# EAGLE schematic Adapter (EAGLE 7.1.0)
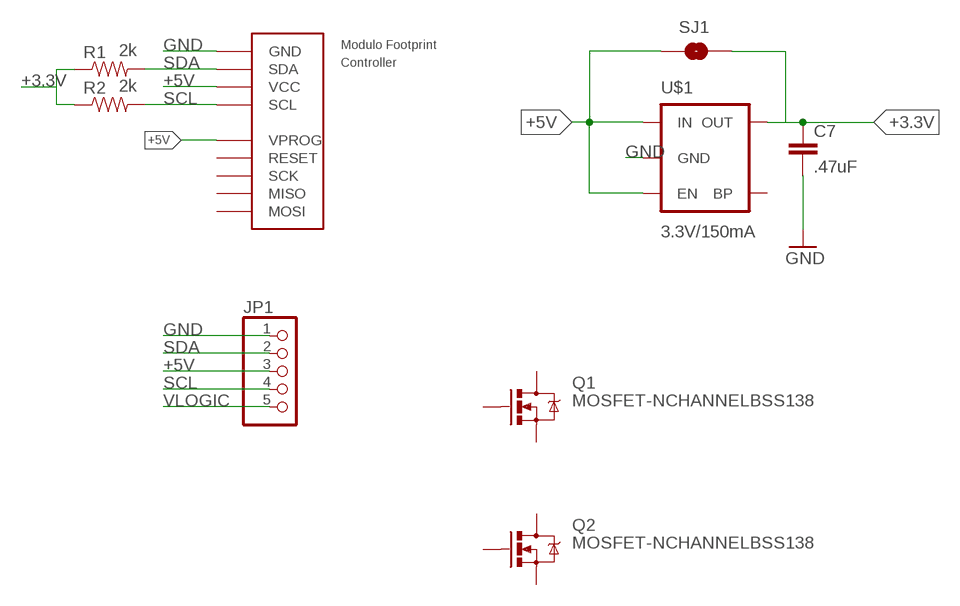
[diagram p0: schematic, sheet 1]

## Parts
C7  .47uF  CAP0805  [0805]
FOOTPRINT  Controller  FOOTPRINTFOOTPRINT-2  [FOOTPRINT2]
JP1  PINHD-1X5/90  [1X05/90]
Q1  MOSFET-NCHANNELBSS138  [SOT23]
Q2  MOSFET-NCHANNELBSS138  [SOT23]
R1  2k  RESISTOR0805-RES  [0805]
R2  2k  RESISTOR0805-RES  [0805]
SJ1  SOLDERJUMPERNO  [SJ_2S-NO]
U$1  3.3V/150mA  V_REG_MIC52053.3V  [SOT23-5]

## Nets
+3.3V: C7.1 R1.1 R2.1 SJ1.2 U$1.5(OUT)
+5V: FOOTPRINT.BUS2(VCC) FOOTPRINT.PROG0(VPROG) JP1.3 SJ1.1 U$1.1(IN) U$1.3(EN)
GND: C7.2 FOOTPRINT.BUS0(GND) JP1.1 U$1.2(GND)
SCL: FOOTPRINT.BUS3(SCL) JP1.4 R2.2
SDA: FOOTPRINT.BUS1(SDA) JP1.2 R1.2
VLOGIC: JP1.5
Unconnected: FOOTPRINT.PROG1(RESET) FOOTPRINT.PROG2(SCK) FOOTPRINT.PROG3(MISO) FOOTPRINT.PROG4(MOSI) Q1.1(G) Q1.2(S) Q1.3(D) Q2.1(G) Q2.2(S) Q2.3(D) U$1.4(BP)

## Library data of the parts
C7 = SparkFun-Capacitors:CAP: Capacitor Standard 0603 ceramic capacitor, and 0.1" leaded capacitor.
FOOTPRINT = IntegerLabs:FOOTPRINT: Modulo Footprint; BOARD: Controller; VERSION: v4
JP1 = pinhead:PINHD-1X5: PIN HEADER
Q1 Q2 = SparkFun-DiscreteSemi:MOSFET-NCHANNEL: Common NMOSFET Parts MFG P/N Store ID Prod ID FDD8780 TRANS-09984 SI7820DN TRANS-11055 FDS6630A IC-08089 2N7002PW TRANS-11151 FQP30N06L COM-10213 TRANS-10060 BSS123LT1G TRANS-08345 BSS138 TRANS-00830 BS170 2N7000; PROD_ID: TRANS-00830
R1 R2 = SparkFun-Resistors:RESISTOR: Resistor Basic schematic elements and footprints for 0603, 1206, and PTH resistors.
SJ1 = SparkFun-Passives:SOLDERJUMPER: Solder Jumper Standard SMD solder jumper. Used to automate production. Two varients : Normally Open and Normally Closed are the same, but have different paste layers. NC will have a large amount of paste and should jumper during reflow.
U$1 = SparkFun-PowerIC:V_REG_MIC5205: V_REG MIC5219 Standard 3.3V and 5V 150mA LDO voltage regulator in SOT-23 layout. Micrel part MIC5205. BP (by-pass) pin is used to lower output noise with 470pF cap, may be left open.; PROD_ID: VREG-00822